# EAGLE design badge2017 (EAGLE 7.3.0)
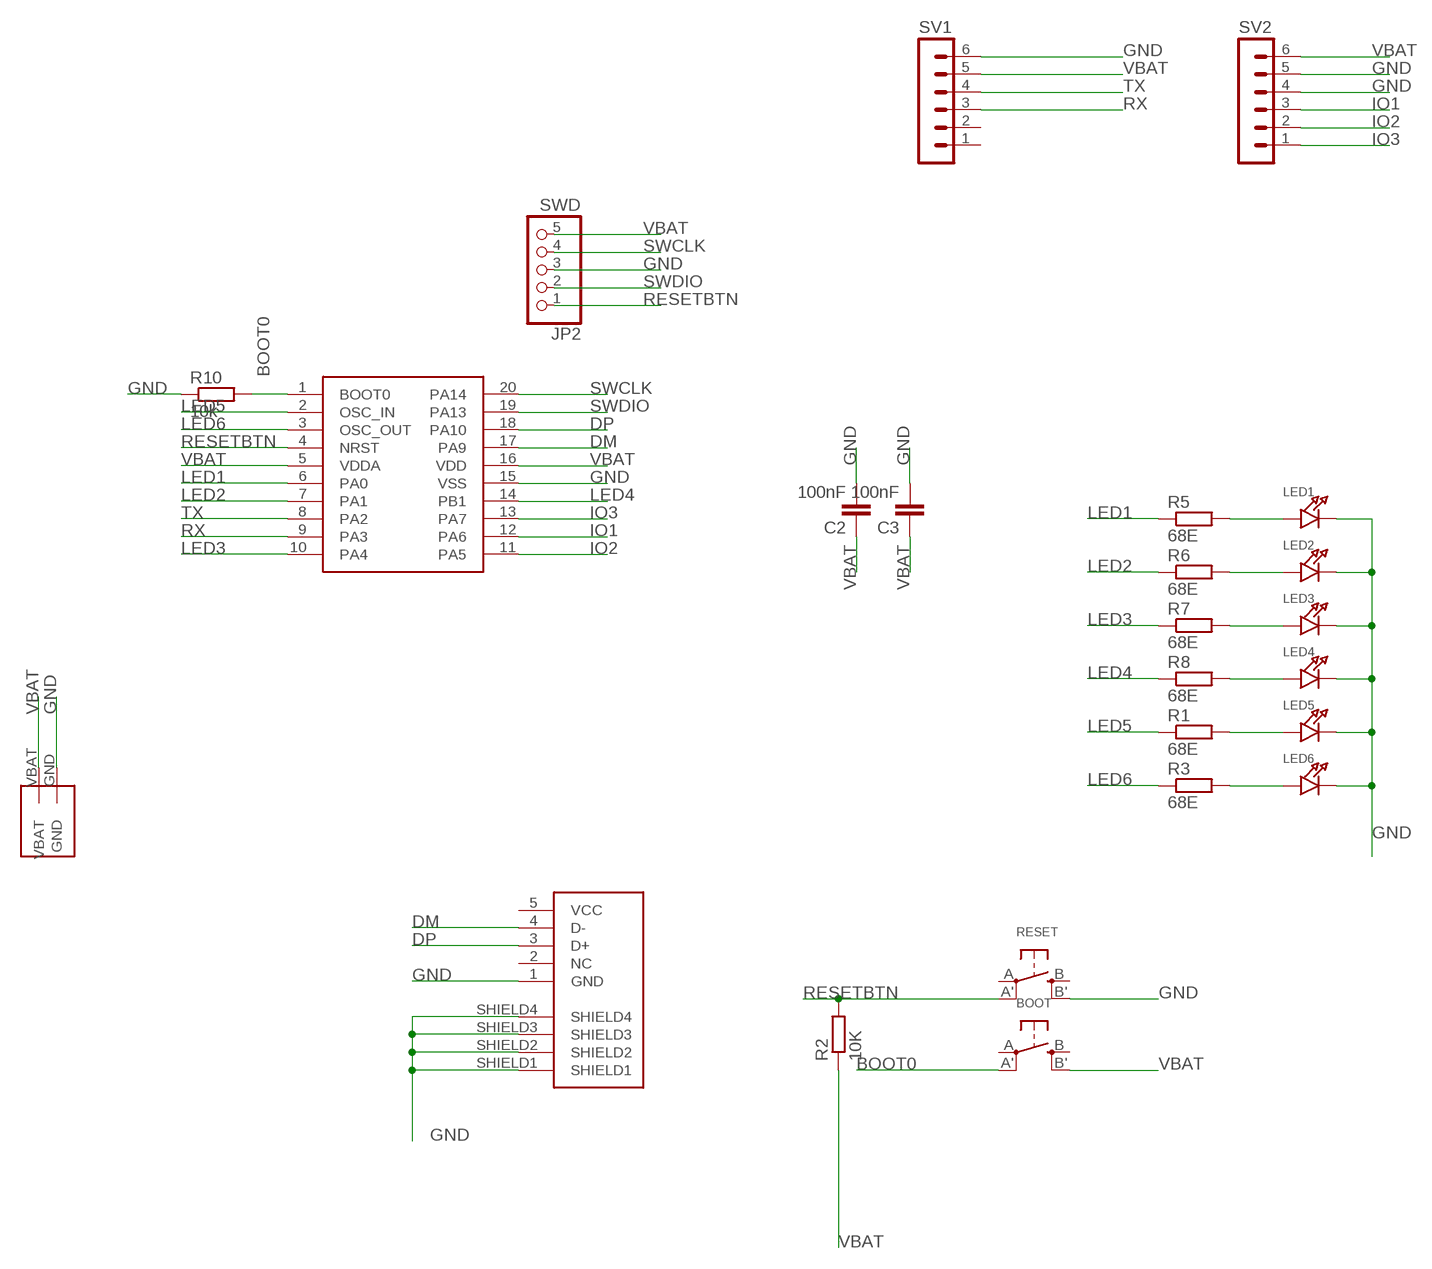
[diagram p0: schematic, sheet 1]

## Parts
BOOT  SWITCH_TACT_SMT  [EVQ-Q2]
C2  100nF  C-EUC0805  [C0805]
C3  100nF  C-EUC0805  [C0805]
JP2  SWD  HEADER-1X5  [1X05_OVAL]
LED1  LED0805_NOOUTLINE  [CHIPLED_0805_NOOUTLINE]
LED2  LED0805_NOOUTLINE  [CHIPLED_0805_NOOUTLINE]
LED3  LED0805_NOOUTLINE  [CHIPLED_0805_NOOUTLINE]
LED4  LED0805_NOOUTLINE  [CHIPLED_0805_NOOUTLINE]
LED5  LED0805_NOOUTLINE  [CHIPLED_0805_NOOUTLINE]
LED6  LED0805_NOOUTLINE  [CHIPLED_0805_NOOUTLINE]
R1  68E  R-EU_R0805  [R0805]
R2  10K  R-EU_R0805  [R0805]
R3  68E  R-EU_R0805  [R0805]
R5  68E  R-EU_R0805  [R0805]
R6  68E  R-EU_R0805  [R0805]
R7  68E  R-EU_R0805  [R0805]
R8  68E  R-EU_R0805  [R0805]
R10  10k  R-EU_R0805  [R0805]
RESET  SWITCH_TACT_SMT  [EVQ-Q2]
STM32  STM32F030X4792-5925  [TSSOP20]
SV1  MA06-1  [MA06-1]
SV2  MA06-1  [MA06-1]
U$1  2AAPCBHOLDER  [2AAPCBBATTHOLDER]
USB  USBSOCK_MINI_SMD  [USBSOCK_MINI_SMD]

## Nets
BOOT0: BOOT.A'(P1) R10.2 STM32.1(BOOT0)
DM: STM32.17(PA9) USB.4(D-)
DP: STM32.18(PA10) USB.3(D+)
GND: C2.2 C3.2 JP2.3 LED1.C LED2.C LED3.C LED4.C LED5.C LED6.C R10.1 RESET.B'(S1) STM32.15(VSS) SV1.6 SV2.4 SV2.5 U$1.GND USB.1(GND) USB.SHIELD1 USB.SHIELD2 USB.SHIELD3 USB.SHIELD4
IO1: STM32.12(PA6) SV2.3
IO2: STM32.11(PA5) SV2.2
IO3: STM32.13(PA7) SV2.1
LED1: R5.1 STM32.6(PA0)
LED2: R6.1 STM32.7(PA1)
LED3: R7.1 STM32.10(PA4)
LED4: R8.1 STM32.14(PB1)
LED5: R1.1 STM32.2(OSC_IN)
LED6: R3.1 STM32.3(OSC_OUT)
N$2: LED1.A R5.2
N$3: LED2.A R6.2
N$4: LED3.A R7.2
N$5: LED4.A R8.2
N$6: LED5.A R1.2
N$8: LED6.A R3.2
RESETBTN: JP2.1 R2.2 RESET.A'(P1) STM32.4(NRST)
RX: STM32.9(PA3) SV1.3
SWCLK: JP2.4 STM32.20(PA14)
SWDIO: JP2.2 STM32.19(PA13)
TX: STM32.8(PA2) SV1.4
VBAT: BOOT.B'(S1) C2.1 C3.1 JP2.5 R2.1 STM32.5(VDDA) STM32.16(VDD) SV1.5 SV2.6 U$1.VBAT
Unconnected: BOOT.A(P) BOOT.B(S) RESET.A(P) RESET.B(S) SV1.1 SV1.2 USB.2(NC) USB.5(VCC)

## Library data of the parts
BOOT RESET = microbuilder:SWITCH_TACT_SMT: SMT Tact Switches 6x6mm - Digikey: P12940SCT-ND KMR2 (4.6x2.8mm) - Digikey: 401-1426-1-ND EVQ-PQHB55 - Light Touch, 160GF (4.5x4.5mm) - Digikey: P8090SCT-ND
C2 C3 = rcl:C-EU: CAPACITOR, European symbol
JP2 = microbuilder:HEADER-1X5: PIN HEADER
LED1-LED6 = microbuilder:LED: LED 0603 - 0603 Surface Mount Package 2mA: Green LED - Low Power (3.9mcd, 2ma, 1.7Vf) - Digikey: 475-2709-2-ND Orange LED - Low Power (9.8mcd, 2ma, 1.8Vf) - Digikey: 475-1194-2-ND Red LED - Low Power (5mcd, 2ma, 1.8Vf) - Digikey: 475-1195-2-ND Yellow LED - Low Power (7mcd, 2ma, 1.8Vf) - Digikey: 475-1196-2-ND 5mA: Blue LED - Low Power (17mcd, 5ma, 2.9Vf) - Digikey: LNJ937W8CRACT-ND 0805 - 0805 Surface Mount Package 2mA: Red LED (8.8mcd, 2mA, 1.8Vf, Clear) - Low Power [Digikey: 475-2510-1-ND] Green LED (5mcd, 2mA, 1.8Vf, Clear) - Low Power [Digikey: 475-2730-1-ND] Yellow LED (11.3mcd, 2mA, 1.8Vf, Clear) - Low Power [Digikey: 475-2555-1-ND] 20mA: Red LED (104mcd, 20mA, Diffused) - LS R976 [Digikey: 475-1278-6-ND] Red LED (12mcd, 20mA, 2.0Vf, Clear) - APT2012EC [Digikey: 754-1128-1-ND] Green LED (15mcd, 20mA, 2.2Vf, Clear) - APT2012GC [Digikey: 754-1131-1-ND] Orange LED (160mcd, 20mA, 2.1Vf, Clear) - APT2012SECK [Digikey: 754-1130-1-ND] 1206 - 1206 Surface Mount Package Green LED (26mcd, 20mA, Diffused) - LG N971 [Digikey: 475-1407-6-ND] Red LED (15mcd, 20mA, Diffused) - LH N974 [Digikey: 475-1416-6-ND]
R1-R3 R5-R8 R10 = rcl:R-EU_: RESISTOR, European symbol
STM32 = protofactory:STM32F030X4
SV1 SV2 = con-lstb:MA06-1: PIN HEADER; OC_FARNELL: unknown; OC_NEWARK: unknown
U$1 = protofactory:2AAPCBHOLDER: 72M0310; MANTECH: 72M0310
USB = protofactory:USBSOCK_MINI_SMD

## Board
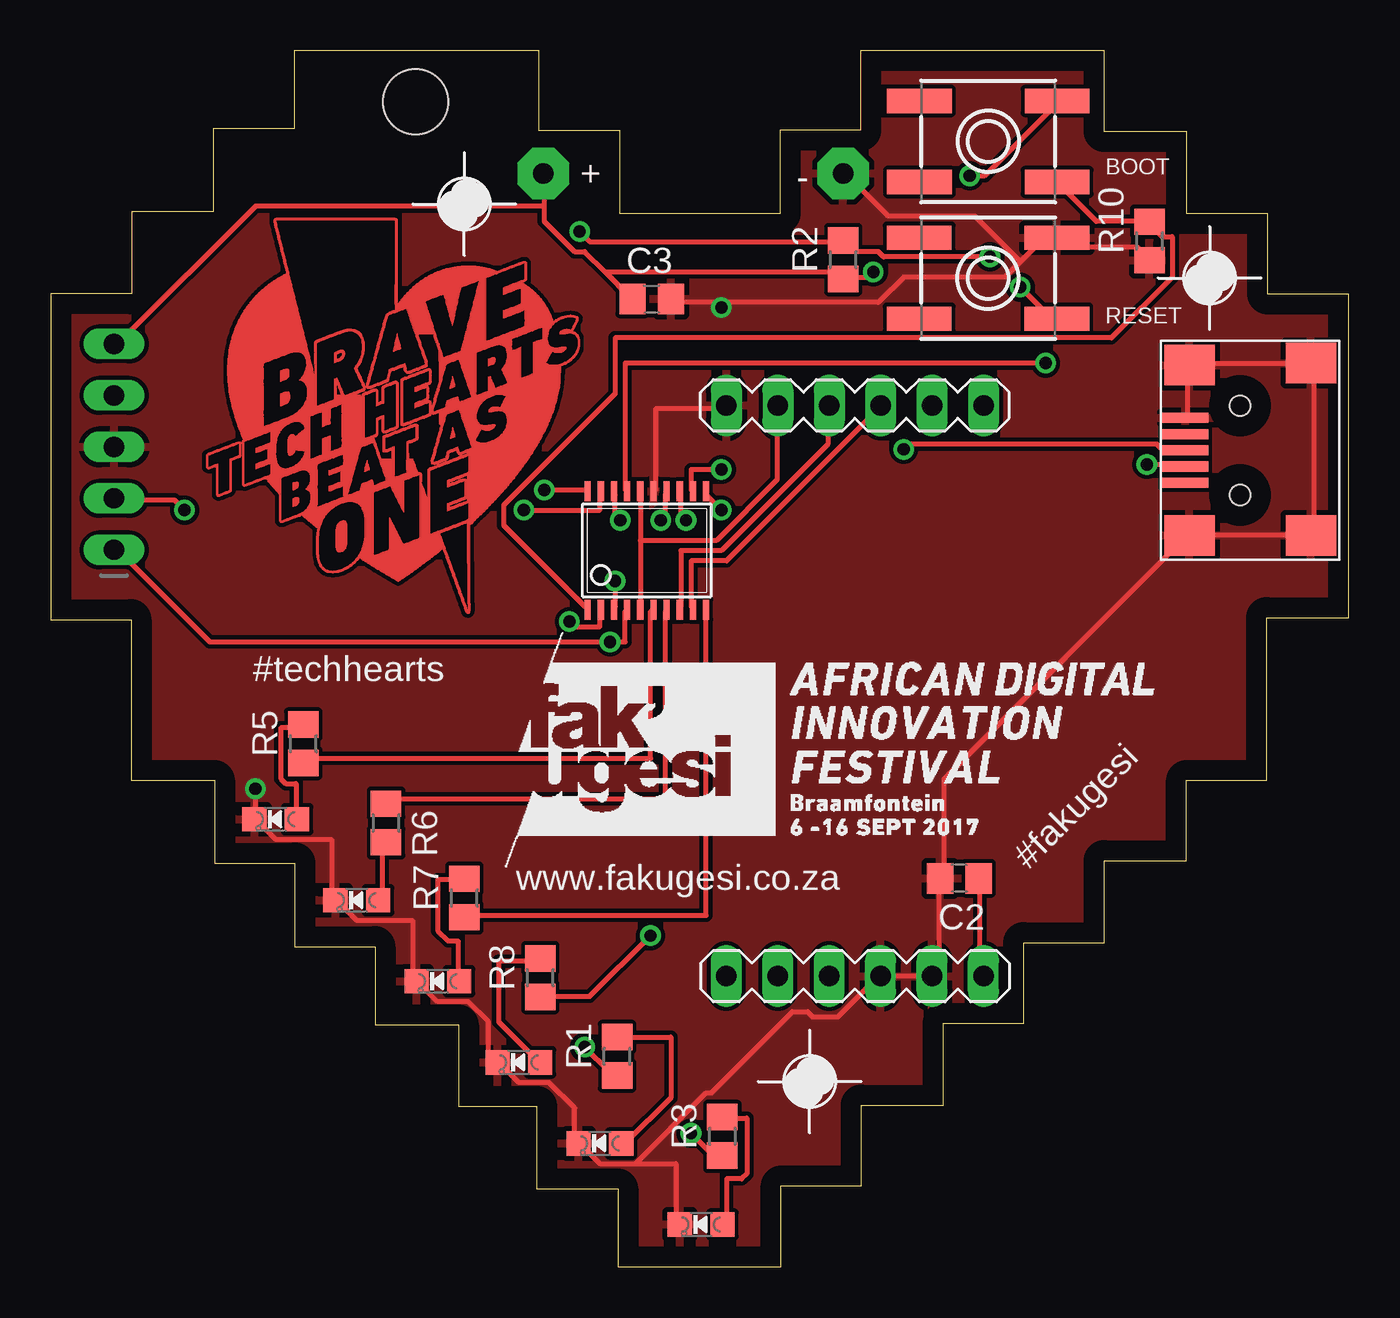
[diagram p1: board, top side]
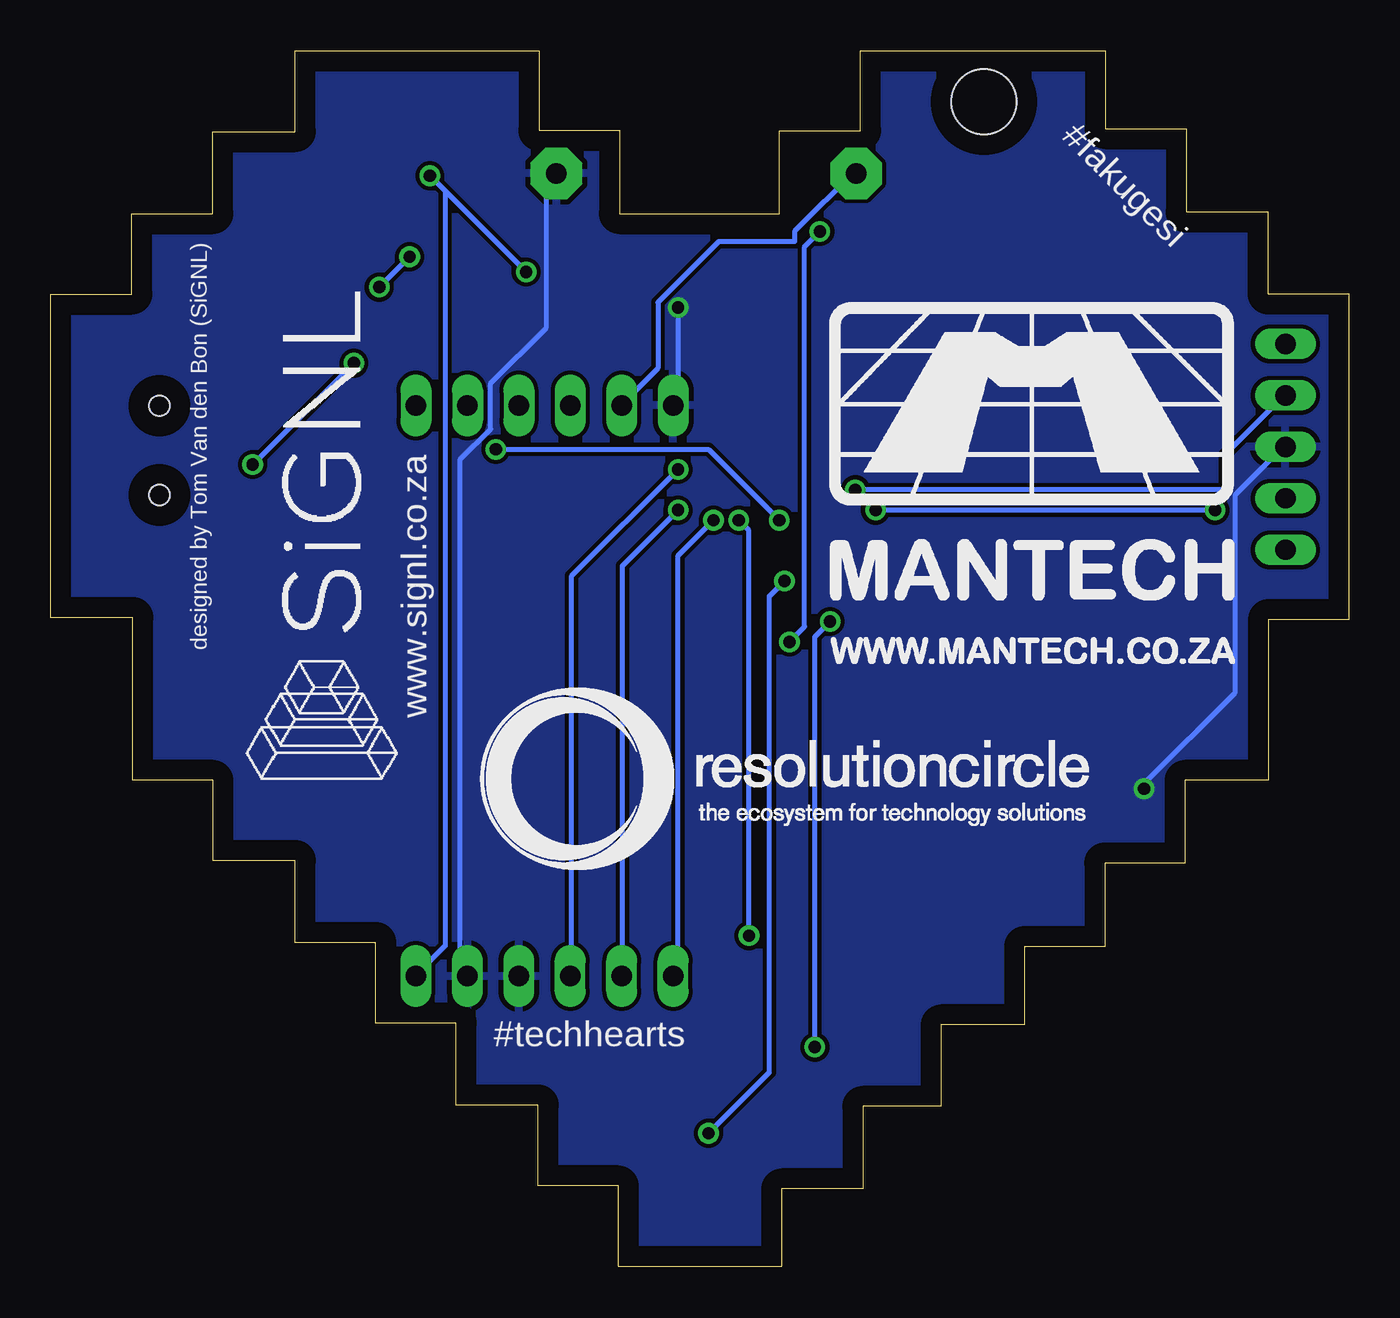
[diagram p2: board, bottom side, seen from below]

Size 64.08 x 60.01 mm. Coordinates in mm from the lower left corner, seen from the top.
Outline: 28.06,0.01 36.05,0.01 36.05,4 40.01,4 40.01,7.98 44.06,7.98 44.06,12.03 48.03,12.03 48.03,16 52,16 52,20.04 56.06,20.04 56.06,24.01 60.02,24.01 60.02,32.04 64.08,32.04 64.08,48 60.07,48 60.07,51.97 56.08,51.97 56.08,56.02 52.01,56.02 52.01,60 39.98,60 39.98,56.08 36,56.08 36,51.97 28.1,51.97 28.1,56.06 24.1,56.06 24.1,60.01 12.03,60.01 12.03,56.16 8.03,56.16 8.03,52.05 4,52.05 4,48.01 0,48.01 0,31.94 3.97,31.94 3.97,24 8.09,24 8.09,19.92 12.05,19.92 12.05,15.8 16.01,15.8 16.01,11.94 20.13,11.94 20.13,7.92 23.99,7.92 23.99,3.85 28,3.85 28,0 28.08,0 28.08,0.01
Copper layers (1*16): Top 0.035mm / dielectric 1.5mm / Bottom 0.035mm
Design rules "default": minimum track width 10mil, minimum drill 24mil, track to track 8mil, track to pad 8mil, pad to pad 8mil, via to via 8mil, smd to smd 8mil, copper to edge 40mil, drill to drill 8mil, minimum pad ring 10mil, minimum via ring 8mil, stop-mask expansion 4mil, vias tented up to drill 0mil, thermal gap 10mil
Holes 3.2 mm at 18.01,57.49

### Footprints (pad centres in the part's own frame; a part is rotated, then mirrored left to right if it is on the bottom)
EVQ-Q2 = smd 3.2 x 1.2: A -3.4,-2; A' 3.4,-2; B -3.4,2; B' 3.4,2
C0805 = smd 1.3 x 1.5: 1 -0.95,0; 2 0.95,0
1X05_OVAL = drill 1 long: 1 -5.08,0; 2 -2.54,0; 3 0,0; 4 2.54,0; 5 5.08,0
CHIPLED_0805_NOOUTLINE = smd 1.2 x 1.2: A 0,-1.05; C 0,1.05
R0805 = smd 1.3 x 1.5: 1 -0.95,0; 2 0.95,0
TSSOP20 = smd 0.305 x 0.991: 1 -2.925,-2.918; 2 -2.275,-2.918; 3 -1.625,-2.918; 4 -0.975,-2.918; 5 -0.325,-2.918; 6 0.325,-2.918; 7 0.975,-2.918; 8 1.625,-2.918; 9 2.275,-2.918; 10 2.925,-2.918; 11 2.925,2.918; 12 2.275,2.918; 13 1.625,2.918; 14 0.975,2.918; 15 0.325,2.918; 16 -0.325,2.918; 17 -0.975,2.918; 18 -1.625,2.918; 19 -2.275,2.918; 20 -2.925,2.918
MA06-1 = drill 1.016 long: 1 -6.35,0; 2 -3.81,0; 3 -1.27,0; 4 1.27,0; 5 3.81,0; 6 6.35,0
2AAPCBBATTHOLDER = drill 1 pad 2.54 octagon: GND 14.8,0; VBAT 0,0
USBSOCK_MINI_SMD = smd 0.5 x 2.25: 1 1.6,1.6; 2 0.8,1.6; 3 0,1.6; 4 -0.8,1.6; 5 -1.6,1.6 | smd 2 x 2.5: SHIELD1 -4.2,1.4; SHIELD2 4.2,1.4; SHIELD3 -4.2,-4.6; SHIELD4 4.3,-4.6 | hole 1: 2.2,-1.1; -2.2,-1.1

### Placement (x,y rotation side)
BOOT  46.28,55.53 0 top
C2  44.85,19.17 180 top
C3  29.67,47.76 0 top
JP2  3.13,40.46 90 top
LED1  11.11,22.09 90 top
LED2  15.11,18.09 90 top
LED3  19.11,14.09 90 top
LED4  23.11,10.09 90 top
LED5  27.11,6.09 90 top
LED6  32.11,2.09 90 top
R1  27.96,10.39 90 top
R2  39.12,49.7 90 top
R3  33.16,6.44 90 top
R5  12.47,25.81 90 top
R6  16.55,21.9 270 top
R7  20.42,18.2 90 top
R8  24.17,14.27 90 top
R10  54.24,50.62 90 top
RESET  46.27,48.78 0 top
STM32  29.43,35.35 0 top
SV1  39.7,42.51 180 top
SV2  39.7,14.35 0 top
U$1  24.32,53.95 0 top
U$2  [PASS-ROUND]  20.41,52.44 0 top
U$3  [PASS-ROUND]  37.46,9.14 0 top
U$4  [PASS-ROUND]  57.21,48.79 0 top
USB  57.61,40.29 90 top

### Tracks (layer width: path | path; a pad name or v marks a point on that pad's centre or on a via)
BOOT0
  Top 0.254: STM32.1 26.36,32.59 22.36,36.59 22.36,37.59 27.86,43.09 27.86,45.84 52.36,45.84 55.36,48.84 55.36,50.84 54.86,50.84 54.36,51.34 R10.2 54.11,51.59 51.61,51.59 49.86,53.34 BOOT.A'
DM  (via drill 0.61)
  Top 0.254: v49.11,44.59 28.36,44.59 28.36,38.34 STM32.17 | v54.11,39.59 55.86,39.59 USB.4
  Bottom 0.254: v54.11,39.59 v49.11,44.59
DP  (via drill 0.61)
  Top 0.254: v28.11,36.84 27.86,36.84 27.86,38.09 STM32.18 | v42.11,40.34 42.36,40.59 54.61,40.59 54.86,40.34 55.86,40.34 USB.3
  Bottom 0.254: v28.11,36.84 31.61,40.34 v42.11,40.34
GND  (via drill 0.61)
  Top 0.254: 10.11,22.09 11.11,21.09 13.86,21.09 13.86,18.09 LED2.C 14.11,18.09 15.11,17.09 17.86,17.09 17.86,14.09 LED3.C 18.11,14.09 19.11,13.09 20.61,13.09 21.61,12.09 21.61,10.09 LED4.C 22.11,10.09 23.11,9.09 24.61,9.09 25.86,7.84 25.86,6.09 LED5.C 26.11,6.09 27.11,5.09 28.86,5.09 | 10.11,22.09 v10.11,23.59 | 10.11,22.09 LED1.C | STM32.15 29.86,38.34 29.86,42.34 33.11,42.34 SV1.6 | 33.11,47.59 40.86,47.59 42.11,48.84 47.11,48.84 47.86,49.59 | 33.11,47.59 30.86,47.59 C3.2 | 48.61,50.34 48.86,50.59 49.61,50.59 RESET.B' 48.61,50.34 | 48.61,50.34 47.86,49.59 | 48.61,50.34 53.61,50.34 54.11,49.84 R10.1 | 47.86,49.59 45.61,51.84 41.36,51.84 39.36,53.84 U$1.GND | 33.11,47.59 v33.11,47.34 | USB.1 56.11,42.09 56.11,44.34 USB.SHIELD2 56.36,44.59 USB.SHIELD4 62.36,44.59 62.36,36.09 USB.SHIELD3 USB.SHIELD1 56.11,36.09 44.11,24.09 44.11,19.34 C2.2 43.86,19.09 43.86,14.59 43.61,14.59 SV2.5 43.36,14.34 41.11,14.34 SV2.4 40.86,14.34 38.86,12.34 37.61,12.34 37.36,12.59 36.61,12.59 32.61,8.59 32.36,8.59 28.86,5.09 | 28.86,5.09 30.86,5.09 30.86,2.09 LED6.C
  Bottom 0.254: v10.11,23.59 10.11,23.84 5.61,28.34 5.61,38.09 3.36,40.34 JP2.3 | v33.11,47.34 33.11,42.59 SV1.6 | U$1.GND 39.36,53.84 39.61,53.59 39.61,46.34 42.36,43.59 42.36,41.34 43.86,39.84 43.86,14.84 43.61,14.59 SV2.5
  pour Top: -1.64,62.84 66.26,62.84 66.26,-2.51 -1.59,-2.51 -1.59,62.79
  pour Bottom: -4.19,64.79 66.91,64.79 66.91,-4.36 -4.19,-4.36 -4.19,64.74
IO1  (via drill 0.61)
  Top 0.254: v33.11,39.34 31.61,39.34 31.61,38.34 STM32.12
  Bottom 0.254: v33.11,39.34 38.36,34.09 38.36,14.59 SV2.3
IO2  (via drill 0.61)
  Top 0.254: v33.11,37.34 32.36,38.09 STM32.11
  Bottom 0.254: v33.11,37.34 35.86,34.59 35.86,14.59 SV2.2
IO3  (via drill 0.61)
  Top 0.254: v31.36,36.84 31.11,36.84 31.11,38.09 STM32.13
  Bottom 0.254: v31.36,36.84 33.11,35.09 33.11,14.59 SV2.1
LED1
  Top 0.254: STM32.6 29.61,32.34 29.61,25.09 12.61,25.09 R5.1
LED2
  Top 0.254: STM32.7 30.36,32.34 30.36,23.09 16.61,23.09 R6.1
LED3
  Top 0.254: STM32.10 32.36,32.34 32.36,17.34 20.61,17.34 R7.1
LED4  (via drill 0.61)
  Top 0.254: v30.11,36.84 30.36,36.84 30.36,38.09 STM32.14 | v29.61,16.34 26.61,13.34 24.36,13.34 R8.1
  Bottom 0.254: v30.11,36.84 29.61,36.34 v29.61,16.34
LED5  (via drill 0.61)
  Top 0.254: v25.61,31.84 25.86,31.59 27.11,31.59 27.11,32.34 STM32.2 | v26.36,10.84 27.61,9.59 27.86,9.59 R1.1
  Bottom 0.254: v25.61,31.84 26.36,31.09 v26.36,10.84
LED6  (via drill 0.61)
  Top 0.254: v27.86,33.84 27.86,32.59 STM32.3 | v31.61,6.59 32.61,5.59 33.11,5.59 R3.1
  Bottom 0.254: v27.86,33.84 28.61,33.09 28.61,9.59 v31.61,6.59
N$2
  Top 0.254: LED1.A 12.11,22.09 12.11,23.84 11.61,23.84 11.36,24.09 11.36,26.59 12.36,26.59 R5.2
N$3
  Top 0.254: LED2.A 16.36,18.09 16.36,20.84 R6.2
N$4
  Top 0.254: LED3.A 20.11,14.09 20.11,16.09 19.61,16.09 19.11,16.59 19.11,19.09 20.36,19.09 R7.2
N$5
  Top 0.254: LED4.A 24.11,10.09 22.11,12.09 22.11,15.09 24.11,15.09 R8.2
N$6
  Top 0.254: R1.2 30.61,11.34 30.61,8.34 28.36,6.09 LED5.A
N$8
  Top 0.254: LED6.A 33.36,2.09 33.36,4.34 34.11,4.34 34.36,4.59 34.36,7.34 33.36,7.34 R3.2
RESETBTN  (via drill 0.61)
  Top 0.254: v46.36,49.84 41.11,49.84 40.86,50.09 39.86,50.09 39.36,50.59 R2.2 39.11,50.59 26.61,50.59 v26.11,51.09 | v47.86,48.34 49.36,46.84 49.61,46.84 RESET.A' | STM32.4 28.36,32.34 28.36,30.84 v27.61,30.84 7.86,30.84 3.36,35.34 JP2.1
  Bottom 0.254: v47.86,48.34 v46.36,49.84 | v26.11,51.09 26.86,50.34 26.86,31.59 v27.61,30.84
RX
  Top 0.254: STM32.9 31.61,32.59 31.61,34.84 33.36,34.84 40.86,42.34 SV1.3
SWCLK  (via drill 0.61)
  Top 0.254: v24.36,38.34 26.36,38.34 STM32.20
  Bottom 0.254: v24.36,38.34 6.11,38.34 6.11,40.09 3.36,42.84 JP2.4
SWDIO  (via drill 0.61)
  Top 0.254: v23.36,37.34 27.11,37.34 27.11,38.09 STM32.19 | v6.61,37.34 6.11,37.84 3.36,37.84 JP2.2
  Bottom 0.254: v6.61,37.34 v23.36,37.34
TX
  Top 0.254: STM32.8 31.11,32.59 31.11,35.34 33.11,35.34 38.36,40.59 38.36,42.34 SV1.4
VBAT  (via drill 0.61)
  Top 0.254: 29.11,35.84 29.11,38.09 STM32.16 | 29.11,35.84 29.11,32.59 STM32.5 | 29.11,35.84 32.86,35.84 35.86,38.84 35.86,42.34 SV1.5 | C2.1 45.86,19.09 45.86,14.59 SV2.6 | 27.36,49.09 26.36,50.09 25.86,50.09 24.36,51.59 24.36,52.34 | 27.36,49.09 28.61,47.84 C3.1 | 24.36,52.34 24.36,53.84 U$1.VBAT | 27.36,49.09 38.86,49.09 39.11,48.84 R2.1 39.36,48.84 40.36,48.84 v40.61,49.09 | 24.36,52.34 10.11,52.34 3.36,45.59 JP2.5 | v45.36,53.84 46.11,53.84 49.61,57.34 BOOT.B'
  Bottom 0.254: v40.61,49.09 44.61,53.09 | 44.61,53.09 v45.36,53.84 | 44.61,53.09 44.61,15.84 45.86,14.59 SV2.6 | SV1.5 35.86,42.59 34.11,44.34 34.11,47.59 31.11,50.59 27.36,50.59 27.36,51.09 24.36,54.09 U$1.VBAT
(copper drawn outside any net)
  shapes: Top area x7239

### Text on the board
tNames: #techhearts | #fakugesi | www.fakugesi.co.za
bNames: #fakugesi | designed by Tom Van den Bon (SiGNL) | www.signl.co.za | #techhearts